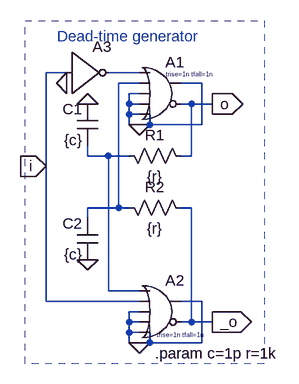
[diagram p0: schematic dead-time-gen.asc]
dead-time-gen.asc, the LTspice schematic file:
Version 4
SHEET 1 880 680
WIRE 64 16 32 16
WIRE 176 16 128 16
WIRE 176 32 144 32
WIRE 272 32 240 32
WIRE 176 48 160 48
WIRE 160 64 160 48
WIRE 176 64 160 64
WIRE 256 64 240 64
WIRE 288 64 256 64
WIRE 160 80 160 64
WIRE 176 80 160 80
WIRE 160 96 160 80
WIRE 176 96 160 96
WIRE 192 96 192 80
WIRE 192 96 176 96
WIRE 272 96 272 32
WIRE 272 96 192 96
WIRE 96 144 96 128
WIRE 128 144 96 144
WIRE 160 144 128 144
WIRE 256 144 256 64
WIRE 256 144 240 144
WIRE 32 160 32 16
WIRE 144 224 144 32
WIRE 144 224 96 224
WIRE 160 224 144 224
WIRE 256 224 240 224
WIRE 96 240 96 224
WIRE 128 352 128 144
WIRE 176 352 128 352
WIRE 32 368 32 160
WIRE 176 368 32 368
WIRE 272 368 240 368
WIRE 176 384 160 384
WIRE 160 400 160 384
WIRE 176 400 160 400
WIRE 256 400 256 224
WIRE 256 400 240 400
WIRE 288 400 256 400
WIRE 160 416 160 400
WIRE 176 416 160 416
WIRE 160 432 160 416
WIRE 176 432 160 432
WIRE 192 432 192 416
WIRE 192 432 176 432
WIRE 272 432 272 368
WIRE 272 432 192 432
FLAG 176 96 0
FLAG 176 432 0
FLAG 96 64 0
FLAG 96 304 0
FLAG 64 32 0
FLAG 288 64 o
IOPIN 288 64 Out
FLAG 288 400 _o
IOPIN 288 400 Out
FLAG 32 160 i
IOPIN 32 160 In
SYMBOL Digital\\or 208 -16 R0
WINDOW 3 9 34 Left 0
SYMATTR Value trise=1n tfall=1n
SYMATTR InstName A1
SYMBOL res 144 128 M90
WINDOW 0 0 56 VBottom 2
WINDOW 3 32 56 VTop 2
SYMATTR InstName R1
SYMATTR Value {r}
SYMBOL cap 112 64 M0
SYMATTR InstName C1
SYMATTR Value {c}
SYMBOL res 144 208 M90
WINDOW 0 0 56 VBottom 2
WINDOW 3 32 56 VTop 2
SYMATTR InstName R2
SYMATTR Value {r}
SYMBOL cap 112 304 R180
WINDOW 0 24 56 Left 2
WINDOW 3 24 8 Left 2
SYMATTR InstName C2
SYMATTR Value {c}
SYMBOL Digital\\inv 64 -48 R0
SYMATTR InstName A3
SYMBOL Digital\\or 208 320 R0
WINDOW 3 -5 100 Left 0
SYMATTR Value trise=1n tfall=1n
SYMATTR InstName A2
TEXT 272 -40 Right 2 ;Dead-time generator
TEXT 200 448 Left 2 !.param c=1p r=1k
RECTANGLE Normal 368 464 0 -64 2

The netlist it stands for:
* dead-time-gen.asc
A1 N001 N002 0 0 0 o 0 0 OR trise=1n tfall=1n
R1 N003 o {r}
C1 0 N003 {c}
R2 N002 _o {r}
C2 0 N002 {c}
A3 i 0 0 0 0 N001 0 0 BUF
A2 N003 i 0 0 0 _o 0 0 OR trise=1n tfall=1n
* Dead-time generator
.param c=1p r=1k
.backanno
.end